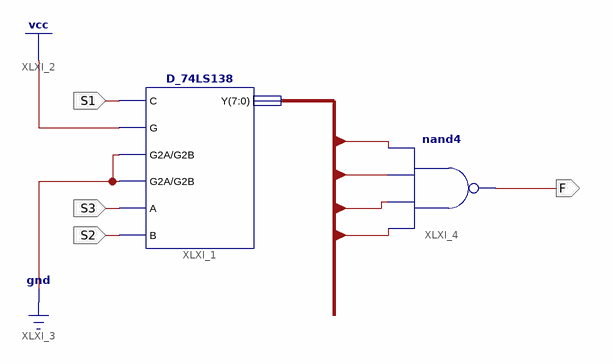
[diagram p0: schematic sheet 1]
// Xilinx ISE schematic LampCtrl138.sch (kintex7) as structural Verilog: 2 symbols, 4 ports
module LampCtrl138 (
  input  S1,
  input  S3,
  input  S2,
  output F
);

  wire [7:0] Y;

  D_74LS138 XLXI_1 (.C(S1), .G(1'b1), .G2A(1'b0), .G2B(1'b0), .A(S3), .B(S2), .Y(Y));
  nand XLXI_4 (F, Y[7], Y[4], Y[2], Y[1]);
endmodule
